# Altium project Test Board ESP32-S3 Mini.PrjPcb (part 1 of 2)
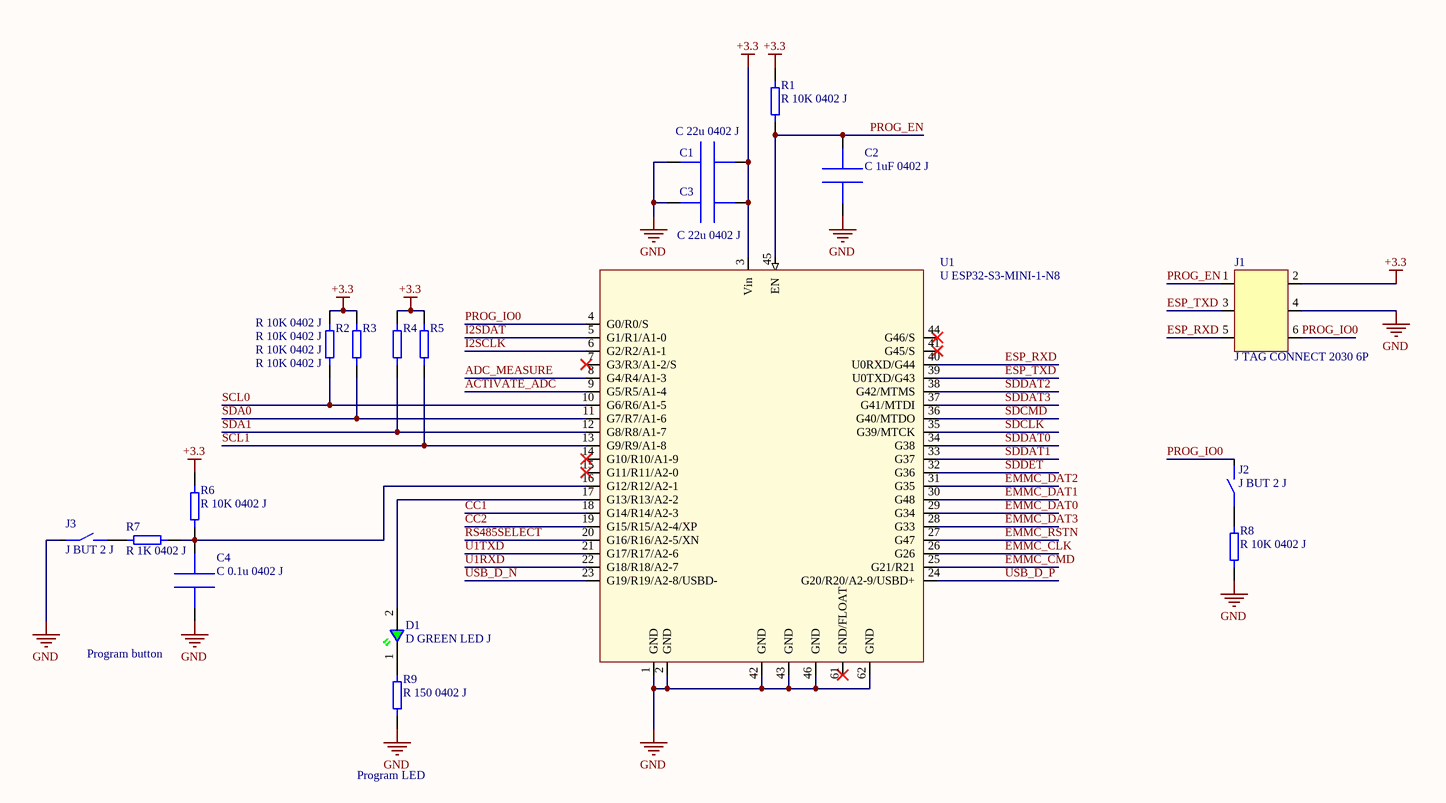
[diagram p0: MCU.SchDoc]
7 sheets, 97 parts. Net scope: global (net labels, ports and power ports of the same name join across sheets).
Board file: board.PcbDoc
Sheets:
  MCU.SchDoc
  Power.SchDoc
  USB.SchDoc
  SD-eMMC.SchDoc
  MIC.SchDoc
  Sensors.SchDoc
  RS-485.SchDoc

## Sheet MCU.SchDoc
size A3; SheetNumber: 1; SheetTotal: 2

### Parts
C1  C 22u 0402 J  [C0402]
C2  C 1uF 0402 J  [C0402]
C3  C 22u 0402 J  [C0402]
C4  C 0.1u 0402 J  [C0402]
D1  D GREEN LED J  [NCD0402C1]
J1  J TAG CONNECT 2030 6P  [TAG-CONNECT-6]  (no BOM)
J2  J BUT 2 J  [ALPSALPINE BUTTON]
J3  J BUT 2 J  [ALPSALPINE BUTTON]
R1  R 10K 0402 J  [R0402]
R2  R 10K 0402 J  [R0402]
R3  R 10K 0402 J  [R0402]
R4  R 10K 0402 J  [R0402]
R5  R 10K 0402 J  [R0402]
R6  R 10K 0402 J  [R0402]
R7  R 1K 0402 J  [R0402]
R8  R 10K 0402 J  [R0402]
R9  R 150 0402 J  [R0402]
U1  U ESP32-S3-MINI-1-N8  [ESP-S3-MINI]

### Nets
+3.3: C1.1 C3.1 J1.2 R1.2 R2.2 R3.2 R4.2 R5.2 R6.2 U1.3(Vin)
GND: C1.2 C2.1 C3.2 C4.1 J1.4 J3.1 R8.1 R9.1 U1.1(GND) U1.2(GND) U1.42(GND) U1.43(GND) U1.46(GND) U1.62(GND)
ACTIVATE_ADC: U1.9(G5/R5/A1-4)
ADC_MEASURE: U1.8(G4/R4/A1-3)
CC1: U1.18(G14/R14/A2-3)
CC2: U1.19(G15/R15/A2-4/XP)
EMMC_CLK: U1.26(G26)
EMMC_CMD: U1.25(G21/R21)
EMMC_DAT0: U1.29(G34)
EMMC_DAT1: U1.30(G48)
EMMC_DAT2: U1.31(G35)
EMMC_DAT3: U1.28(G33)
EMMC_RSTN: U1.27(G47)
ESP_RXD: J1.5 U1.40(U0RXD/G44)
ESP_TXD: J1.3 U1.39(U0TXD/G43)
I2SCLK: U1.6(G2/R2/A1-1)
I2SDAT: U1.5(G1/R1/A1-0)
PROG_EN: C2.2 J1.1 R1.1 U1.45(EN)
PROG_IO0: J1.6 J2.2 U1.4(G0/R0/S)
RS485SELECT: U1.20(G16/R16/A2-5/XN)
SCL0: R2.1 U1.10(G6/R6/A1-5)
SCL1: R5.1 U1.13(G9/R9/A1-8)
SDA~{0}: R3.1 U1.11(G7/R7/A1-6)
SDA1: R4.1 U1.12(G8/R8/A1-7)
SDCLK: U1.35(G39/MTCK)
SDCMD: U1.36(G40/MTDO)
SDDAT0: U1.34(G38)
SDDAT1: U1.33(G37)
SDDAT2: U1.38(G42/MTMS)
SDDAT3: U1.37(G41/MTDI)
SDDET: U1.32(G36)
U1RXD: U1.22(G18/R18/A2-7)
U1TXD: U1.21(G17/R17/A2-6)
USB_D_N: U1.23(G19/R19/A2-8/USBD-)
USB_D_P: U1.24(G20/R20/A2-9/USBD+)
NetC4_2: C4.2 R6.1 R7.2 U1.16(G12/R12/A2-1)
NetD1_1: D1.1 R9.2
NetD1_2: D1.2 U1.17(G13/R13/A2-2)
NetJ2_1: J2.1 R8.2
NetJ3_2: J3.2 R7.1

Not connected (* = marked no-connect by the designer): U1 7(G3/R3/A1-2/S)* 14(G10/R10/A1-9)* 15(G11/R11/A2-0)* 41(G45/S)* 44(G46/S)* 61(GND/FLOAT)*

### Notes on the sheet
- (near C4) Program button
- Program LED

### Library data of the parts
C1 C3 = C 22u 0402 J: Multi-Layer Ceramic Capacitor 22uF 2.5VDC X6S 20% 0402 Paper T/R GRM155C80E226ME11D; Manufacturer: Murata; Supplier 1: Mouser; Manufacturer Part Number: GRM155C80E226ME11D; RoHS: Yes; Category: Ceramic Capacitors; Stock 1: 30000; Pricing 1: 1=0,32000, 10=0,22300, 50=0,22300, 100=0,13400, 1000=0,08500, 10000=0,06900 (USD); Supplier Part Number 1: 81-GRM155C80E226ME1D; JLCPCB: C907955
C2 = C 1uF 0402 J: Ceramic capacitor SMD 0402 - 1000nF, 10V, +-10%, X5R CL05A105KP5NNNC; Manufacturer: Samsung; Tolerance: 10%; Supplier 1: Arrow Electronics; Manufacturer Part Number: CL05A105KP5NNNC; RoHS: Yes; Category: Ceramic Capacitors; Stock 1: 131; Pricing 1: 1=0,06300, 10=0,04210, 25=0,03040, 100=0,01620, 500=0,01020 (USD); Mount: Surface Mount; Case/Package: 0402; Case Code (Metric): 1005; Case Code (Imperial): 0402; Contact Plating: Tin; Material: Ceramic; Min Operating Temperature: -55°C; Max Operating Temperature: 85°C; Capacitance: 1uF; Package Quantity: 1; Packaging: Tape and Reel; Voltage Rating: 10V; Dielectric: X5R; Series: CL; Length: 1mm; Width: 0.02inch; Height: 0.5mm; Thickness: 0.022inch; Depth: 0.5mm; Radiation Hardening: No; RoHS Compliant: Yes; ComponentLink1URL: http://www.farnell.com/datasheets/2710650.pdf?src-supplier=Farnell; ComponentLink1Description: http://www.farnell.com/datasheets/2710650.pdf?src-supplier=Farnell; ComponentLink2URL: http://www.samsungsem.com/kr/support/product-search/mlcc/CL05A105KP5NNNC.jsp?src-supplier=Digi-Key; ComponentLink2Description: http://www.samsungsem.com/kr/support/product-search/mlcc/CL05A105KP5NNNC.jsp?src-supplier=Digi-Key; ComponentLink3URL: http://www.farnell.com/datasheets/2710650.pdf?src-supplier=Element14; ComponentLink3Description: http://www.farnell.com/datasheets/2710650.pdf?src-supplier=Element14; Supplier 2: Digi-Key; Stock 2: 6411089; Pricing 2: 1=0,10000, 10=0,03600, 50=0,01960, 100=0,01610, 500=0,01148, 1000=0,00903, 2500=0,00821, 5000=0,00755 (USD); Supplier 3: Mouser; Stock 3: 1468368; Pricing 3: 1=0,10000, 10=0,02200, 50=0,02200, 100=0,01700, 500=0,01300, 1000=0,01000, 2500=0,00900, 10000=0,00600, 50000=0,00500 (USD); Supplier Part Number 1: CL05A105KP5NNNC; Supplier Part Number 2: 1276-1076-1-ND; Supplier Part Number 3: 187-CL05A105KP5NNNC; JLCPCB: C14445
C4 = C 0.1u 0402 J: Cap Ceramic 0.1uF 50V X7R 10% Pad SMD 0402 125C Low ESR Automotive CL05B104KB54PNC; Manufacturer: Samsung; Supplier 1: Digi-Key; Manufacturer Part Number: CL05B104KB54PNC; RoHS: Yes; Category: Ceramic Capacitors; Stock 1: 3863336; Pricing 1: 1=0,10000, 10=0,04600, 50=0,02500, 100=0,02040, 500=0,01460, 1000=0,01147, 2500=0,01043, 5000=0,00959 (USD); RoHS Compliant: Yes; Supplier Part Number 1: 1276-CL05B104KB54PNCCT-ND; JLCPCB: C307331
D1 = D GREEN LED J: Green/Yellow-Green 0402 Light Emitting Diodes (LED) ROHS NCD0402C1; Manufacturer: Foshan NationStar Optoelectronics; Manufacturer Part Number: NCD0402C1; JLCPCB: C130722
J1 = J TAG CONNECT 2030 6P: Direct programming with TAG CONNECT 2030
J2 J3 = J BUT 2 J: Switch Tactile N.O. SPST Round Button Gull Wing 0.05A 12VDC 1.57N SMD T/R SKRKAEE020; Manufacturer: Alps Electric; Supplier 1: Newark; Manufacturer Part Number: SKRKAEE020; RoHS: Yes; Category: Tactile Switches; Stock 1: 31500; Pricing 1: 4500=0,13500 (USD); RoHS Compliant: Yes; Supplier 2: Mouser; Stock 2: 43207; Pricing 2: 1=0,76000, 10=0,67100, 50=0,60600, 100=0,51800, 1000=0,43900, 10000=0,37600 (USD); Supplier 3: RSComponents; JLCPCB: C115357; Supplier Part Number 3: 194714; Supplier Part Number 2: 688-SKRKAEE020; Supplier Part Number 1: 79AH6587
R1-R6 R8 = R 10K 0402 J: Res Thick Film 0402 10K Ohm 1% 0.063W(1/16W) ±100ppm/C Pad SMD Automotive T/R AC0402FR-0710KL; Manufacturer: Yageo; Resistance: 10kR; Power Rating: 62.5mW; Voltage Rating: 50V; Temperature Coefficient: 100ppm/°C; Max Power Dissipation: 63mW; Supplier 1: Arrow Electronics; Manufacturer Part Number: AC0402FR-0710KL; RoHS: Yes; Category: Chip SMD Resistors; Stock 1: 46; Pricing 1: 1=0,08140, 10=0,02850, 25=0,02750 (USD); Case/Package: 0402; Case Code (Imperial): 0402; Case Code (Metric): 1005; Size Code: 0402; Min Operating Temperature: -55°C; Max Operating Temperature: 155°C; Tolerance: 1%; Packaging: Tape and Reel; Resistor Type: Thick Film; Termination: SMD/SMT; Number of Terminations: 2; Features: Moisture Resistant,Automotive AEC-Q200; Series: AC; Construction: Rectangular; Length: 0.039inch; Width: 0.02inch; Height: 0.015inch; Depth: 0.5mm; Military Standard: Not; Lead Free: Lead Free; RoHS Compliant: Yes; ComponentLink1URL: https://datasheet.ciiva.com/12656/pyu-ac-51-rohs-l-2-12656634.pdf?src-supplier=Mouser; ComponentLink1Description: https://datasheet.ciiva.com/12656/pyu-ac-51-rohs-l-2-12656634.pdf?src-supplier=Mouser; Supplier 2: RSComponents; Stock 2: 17000; Pricing 2: 10000=0,00200 (GBP); Supplier 3: Digi-Key; Stock 3: 1574588; Pricing 3: 1=0,10000, 10=0,02000, 100=0,00830, 1000=0,00371, 2500=0,00322, 5000=0,00266 (USD); Supplier 4: Mouser; Stock 4: 3990115; Pricing 4: 1=0,10000, 10=0,01500, 50=0,01500, 100=0,00700, 1000=0,00300, 5000=0,00200, 10000=0,00200 (USD); Supplier Part Number 1: AC0402FR-0710KL; Supplier Part Number 2: 1977965; Supplier Part Number 3: YAG3436CT-ND; Supplier Part Number 4: 603-AC0402FR-0710KL; JLCPCB: C144807
R7 = R 1K 0402 J: Res Thick Film 0402 1K Ohm 1% 0.063W(1/16W) ±100ppm/C Pad SMD Automotive T/R; Manufacturer: Yageo; Manufacturer Part Number: AC0402FR-071KL; Resistance: 1kR; Power Rating: 62.5mW; Voltage Rating: 50V; Max Power Dissipation: 63mW; Temperature Coefficient: 100ppm/°C; Supplier 1: Arrow Electronics; RoHS: Yes; Category: Chip SMD Resistors; Stock 1: 269; Pricing 1: 1=0,05050, 10=0,03670, 25=0,01910, 100=0,00800, 250=0,00790 (USD); Case/Package: 0402; Case Code (Metric): 1005; Case Code (Imperial): 0402; Size Code: 0402; Min Operating Temperature: -55°C; Max Operating Temperature: 155°C; Package Quantity: 1; Tolerance: 1%; Packaging: Tape and Reel; Resistor Type: Thick Film; Number of Terminations: 2; Termination: SMD/SMT; Features: Moisture Resistant,Automotive AEC-Q200,Anti-Sulfur; Series: AC; Construction: Rectangular; Length: 0.039inch; Width: 0.02inch; Height: 0.015inch; Depth: 0.5mm; Military Standard: Not; Lead Free: Lead Free; RoHS Compliant: Yes; ComponentLink1URL: http://www.mouser.com/ds/2/447/yageodocoutput-1111992.pdf?src-supplier=Mouser; ComponentLink1Description: http://www.mouser.com/ds/2/447/yageodocoutput-1111992.pdf?src-supplier=Mouser; ComponentLink2URL: http://www.yageo.com/NewPortal/yageodocoutput?fileName=/pdf/R-Chip/PYu-AC_51_RoHS_L_6.pdf&src-supplier=Digi-Key; ComponentLink2Description: http://www.yageo.com/NewPortal/yageodocoutput?fileName=/pdf/R-Chip/PYu-AC_51_RoHS_L_6.pdf&src-supplier=Digi-Key; ComponentLink3URL: http://www.yageo.com/documents/recent/PYu-AC_51_RoHS_L_2_revised.pdf?src-supplier=Future+Electronics; ComponentLink3Description: http://www.yageo.com/documents/recent/PYu-AC_51_RoHS_L_2_revised.pdf?src-supplier=Future+Electronics; Supplier 2: RSComponents; Stock 2: 109000; Pricing 2: 5000=0,00300 (GBP); Supplier 3: Digi-Key; Stock 3: 1440182; Pricing 3: 1=0,10000, 10=0,02000, 100=0,00830, 1000=0,00371, 2500=0,00322, 5000=0,00266 (USD); Supplier 4: Mouser; Stock 4: 1563596; Pricing 4: 1=0,10000, 10=0,01500, 50=0,01500, 100=0,00700, 1000=0,00300, 10000=0,00200 (USD); Supplier Part Number 1: AC0402FR-071KL; Supplier Part Number 2: 1977971P; Supplier Part Number 3: 311-1KLBCT-ND; Supplier Part Number 4: 603-AC0402FR-071KL; JLCPCB: C144789
R9 = R 150 0402 J: Res General Purpose Thick Film 0402 150 Ohm 1% 1/16W ±100ppm/°C Molded SMD Paper T/R RC0402FR-07150RL; Manufacturer: Yageo; Resistance: 150R; Power Rating: 62.5mW; Voltage Rating: 50V; Max Power Dissipation: 63mW; Supplier 1: Arrow Electronics; Manufacturer Part Number: RC0402FR-07150RL; RoHS: Yes; Category: Chip SMD Resistors; Stock 1: 70000; Pricing 1: 10000=0,00140 (USD); Case/Package: 0402; Case Code (Metric): 1005; Case Code (Imperial): 0402; Min Operating Temperature: -55°C; Max Operating Temperature: 155°C; Tolerance: 1%; Packaging: Tape and Reel; Package Quantity: 1; Resistor Type: Thick Film; Number of Terminations: 2; Termination: SMD/SMT; Temperature Coefficient: 100ppm/°C; Working Voltage: 50V; Features: Moisture Resistant; Series: RC; Resistance Tolerance: 1%; Construction: Rectangular; Technology: THICK FILM; Length: 1mm; Width: 0.02inch; Height: 0.016inch; Depth: 0.5mm; REACH SVHC: No SVHC; Military Standard: Not; Lead Free: Lead Free; RoHS Compliant: Yes; ComponentLink1URL: https://datasheet.ciiva.com/11808/0900766b80c66297-11808422.pdf?src-supplier=RSComponents; ComponentLink1Description: https://datasheet.ciiva.com/11808/0900766b80c66297-11808422.pdf?src-supplier=RSComponents; ComponentLink2URL: https://datasheet.ciiva.com/7983/1018594-7983495.pdf?src-supplier=Element14; ComponentLink2Description: https://datasheet.ciiva.com/7983/1018594-7983495.pdf?src-supplier=Element14; ComponentLink3URL: https://datasheet.ciiva.com/2453/pyu-r-int-thick-7-2453374.pdf?src-supplier=Digi-Key; ComponentLink3Description: https://datasheet.ciiva.com/2453/pyu-r-int-thick-7-2453374.pdf?src-supplier=Digi-Key; ComponentLink4URL: https://datasheet.ciiva.com/2453/pyu-r-int-thick-7-2453375.pdf?src-supplier=Digi-Key; ComponentLink4Description: https://datasheet.ciiva.com/2453/pyu-r-int-thick-7-2453375.pdf?src-supplier=Digi-Key; ComponentLink5URL: https://datasheet.ciiva.com/2453/pyu-r-int-thick-7-2453373.pdf?src-supplier=Digi-Key; ComponentLink5Description: https://datasheet.ciiva.com/2453/pyu-r-int-thick-7-2453373.pdf?src-supplier=Digi-Key; ComponentLink6URL: https://datasheet.ciiva.com/5558/pyu-rc0402-51-rohs-l-6-r-5558110.pdf?src-supplier=Mouser; ComponentLink6Description: https://datasheet.ciiva.com/5558/pyu-rc0402-51-rohs-l-6-r-5558110.pdf?src-supplier=Mouser; ComponentLink7URL: https://datasheet.ciiva.com/7849/1018594-7849838.pdf?src-supplier=Element14; ComponentLink7Description: https://datasheet.ciiva.com/7849/1018594-7849838.pdf?src-supplier=Element14; ComponentLink8URL: https://datasheet.ciiva.com/7849/1018594-7849839.pdf?src-supplier=Element14; ComponentLink8Description: https://datasheet.ciiva.com/7849/1018594-7849839.pdf?src-supplier=Element14; ComponentLink9URL: https://datasheet.ciiva.com/16740/pyu-rc0402-51-rohs-l-6-r-16740923.pdf?src-supplier=Future+Electronics; ComponentLink9Description: https://datasheet.ciiva.com/16740/pyu-rc0402-51-rohs-l-6-r-16740923.pdf?src-supplier=Future+Electronics; ComponentLink10URL: https://datasheet.ciiva.com/15189/getdatasheetpartid-330680-15189357.pdf?src-supplier=Verical; ComponentLink10Description: https://datasheet.ciiva.com/15189/getdatasheetpartid-330680-15189357.pdf?src-supplier=Verical; Supplier 2: RSComponents; Stock 2: 10800; Pricing 2: 10000=0,00200, 50000=0,00200, 100000=0,00200, 200000=0,00200, 400000=0,00200 (GBP); Supplier 3: Digi-Key; Stock 3: 2629290; Pricing 3: 1=0,10000, 10=0,01500, 100=0,00610, 1000=0,00275, 2500=0,00239, 5000=0,00197 (USD); JLCPCB: C138054; Supplier Part Number 1: RC0402FR-07150RL; Supplier Part Number 2: 1987666; Supplier Part Number 3: 311-150LRCT-ND
U1 = U ESP32-S3-MINI-1-N8: SMD Module, ESP32-S3FN8, 8 mb Sp ESP32-S3-MINI-1-N8; Manufacturer: Espressif Systems; Supplier 1: Digi-Key; Manufacturer Part Number: ESP32-S3-MINI-1-N8; RoHS: No; Category: Uncategorized; Stock 1: 6782; Pricing 1: 1=3,41000 (USD); JLCPCB: C2913206; Supplier Part Number 1: 1965-ESP32-S3-MINI-1-N8-ND; ComponentLink1Description: Real datasheet; ComponentLink1URL: https://www.espressif.com/sites/default/files/documentation/esp32-s3-mini-1_mini-1u_datasheet_en.pdf

## Sheet Power.SchDoc
size A4; SheetNumber: 2; SheetTotal: 2
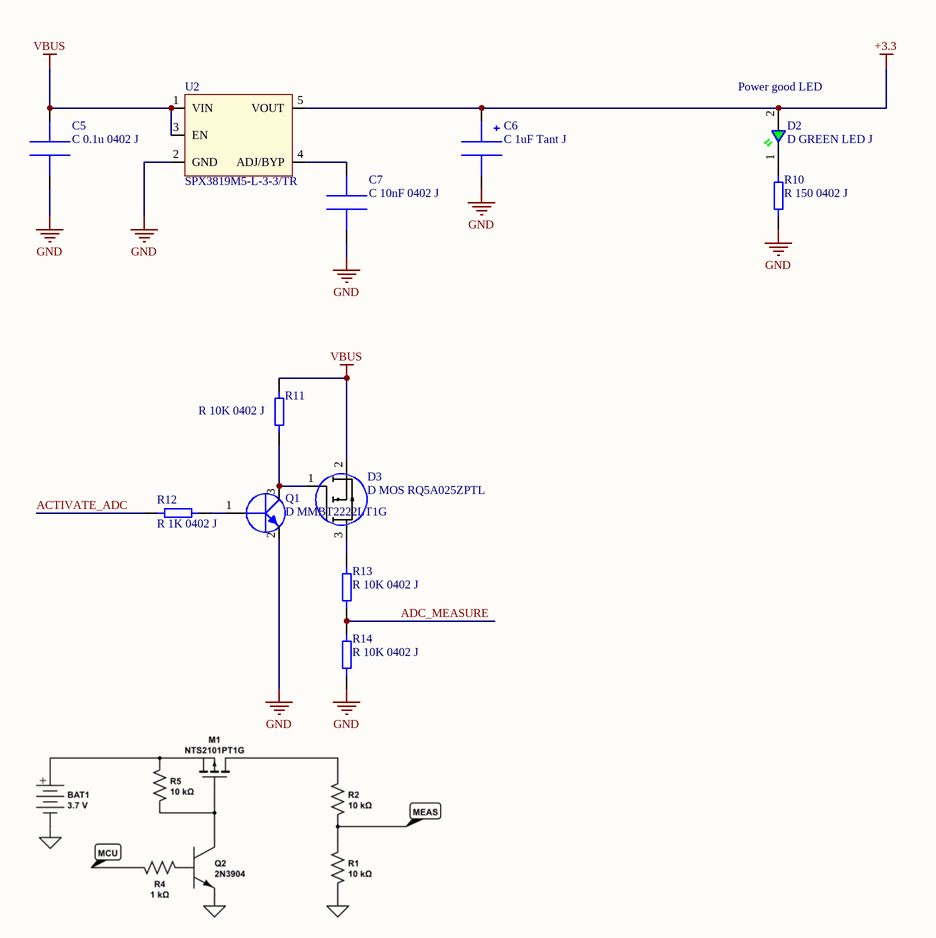
[diagram p1: Power.SchDoc]

### Parts
C5  C 0.1u 0402 J  [C0402]
C6  C 1uF Tant J  [C AVX CAP TANT CASE A]
C7  C 10nF 0402 J  [C0402]
D2  D GREEN LED J  [NCD0402C1]
D3  D MOS RQ5A025ZPTL  [SC96 SOT346T]
Q1  D MMBT2222LT1G  [SOT23]
R10  R 150 0402 J  [R0402]
R11  R 10K 0402 J  [R0402]
R12  R 1K 0402 J  [R0402]
R13  R 10K 0402 J  [R0402]
R14  R 10K 0402 J  [R0402]
U2  SPX3819M5-L-3-3/TR  [SOT23-5]

### Nets
+3.3: C6.A D2.2 U2.5(VOUT)
GND: C5.1 C6.K C7.1 Q1.2 R10.1 R14.1 U2.2(GND)
VBUS: C5.2 D3.2(S) R11.2 U2.1(VIN) U2.3(EN)
ACTIVATE_ADC: R12.1
ADC_MEASURE: R13.1 R14.2
NetC7_2: C7.2 U2.4(ADJ/BYP)
NetD2_1: D2.1 R10.2
NetD3_1: D3.1(G) Q1.3 R11.1
NetD3_3: D3.3(D) R13.2
NetQ1_1: Q1.1 R12.2

### Notes on the sheet
- (near D2) Power good LED

### Library data of the parts
C5 = C 0.1u 0402 J: as C4 on sheet MCU; Supplier 1: Digi-Key; Manufacturer Part Number: CL05B104KB54PNC; RoHS: Yes; Category: Ceramic Capacitors; Stock 1: 3863336; Pricing 1: 1=0,10000, 10=0,04600, 50=0,02500, 100=0,02040, 500=0,01460, 1000=0,01147, 2500=0,01043, 5000=0,00959 (USD); RoHS Compliant: Yes; Supplier Part Number 1: 1276-CL05B104KB54PNCCT-ND; JLCPCB: C307331
C6 = C 1uF Tant J: Cap Tant Solid 1uF 16V A CASE 10%( 3.2 X 1.6 X 1.6mm) Inward L SMD 3216-18 11 Ohm 125C T/R TAJA105K016RNJ; Manufacturer: Kyocera AVX; Dielectric Material: Tantalum; Tolerance: 20%; ESR (Equivalent Series Resistance): 11R; Polarity: Polar; Leakage Current: 500nA; Dissipation Factor: 4%; Supplier 1: Digi-Key; Manufacturer Part Number: TAJA105K016RNJ; RoHS: Yes; Category: Tantalum Capacitors; Stock 1: 449202; Pricing 1: 2000=0,09159, 4000=0,08650, 10000=0,08141, 14000=0,07886, 50000=0,07123 (USD); Mount: Surface Mount,PCB; Case/Package: 1206; Number of Pins: 2; Case Code (Metric): 3216; Case Code (Imperial): 1206; Weight: 0.000571oz; Min Operating Temperature: -55°C; Max Operating Temperature: 125°C; Capacitance: 1uF; Voltage Rating (DC): 16V; Packaging: Tape and Reel; Package Quantity: 1; Voltage Rating: 16V; Termination: SMD/SMT; Voltage: 16V; Features: General Purpose; Series: TAJ; Length: 3.2mm; Width: 1.6mm; Height: 1.6mm; Height - Seated (Max): 0.071inch; Depth: 1.6mm; Lead Pitch: 1.1mm; Radiation Hardening: No; REACH SVHC: No SVHC; Lead Free: Lead Free; RoHS Compliant: Yes; ComponentLink1URL: https://datasheet.ciiva.com/18710/taj-eng-18710647.pdf?src-supplier=Distrelec; ComponentLink1Description: https://datasheet.ciiva.com/18710/taj-eng-18710647.pdf?src-supplier=Distrelec; ComponentLink2URL: https://datasheet.ciiva.com/7832/taj-7832811.pdf?src-supplier=Element14; ComponentLink2Description: https://datasheet.ciiva.com/7832/taj-7832811.pdf?src-supplier=Element14; ComponentLink3URL: https://datasheet.ciiva.com/7832/taj-7832810.pdf?src-supplier=Element14; ComponentLink3Description: https://datasheet.ciiva.com/7832/taj-7832810.pdf?src-supplier=Element14; ComponentLink4URL: https://datasheet.ciiva.com/7832/1680476-7832431.pdf?src-supplier=Element14; ComponentLink4Description: https://datasheet.ciiva.com/7832/1680476-7832431.pdf?src-supplier=Element14; ComponentLink5URL: https://datasheet.ciiva.com/263/taj-263410.pdf?src-supplier=Digi-Key; ComponentLink5Description: https://datasheet.ciiva.com/263/taj-263410.pdf?src-supplier=Digi-Key; ComponentLink6URL: https://datasheet.ciiva.com/263/taj-263409.pdf?src-supplier=Digi-Key; ComponentLink6Description: https://datasheet.ciiva.com/263/taj-263409.pdf?src-supplier=Digi-Key; ComponentLink7URL: https://datasheet.ciiva.com/263/taj-263411.pdf?src-supplier=Digi-Key; ComponentLink7Description: https://datasheet.ciiva.com/263/taj-263411.pdf?src-supplier=Digi-Key; ComponentLink8URL: https://datasheet.ciiva.com/7832/1703059-7832429.pdf?src-supplier=Element14; ComponentLink8Description: https://datasheet.ciiva.com/7832/1703059-7832429.pdf?src-supplier=Element14; ComponentLink9URL: https://datasheet.ciiva.com/7832/1703059-7832430.pdf?src-supplier=Element14; ComponentLink9Description: https://datasheet.ciiva.com/7832/1703059-7832430.pdf?src-supplier=Element14; Supplier 2: RSComponents; Stock 2: 1; Pricing 2: 20=0,28300, 100=0,27000, 200=0,25900, 500=0,23500, 1000=0,20900 (USD); JLCPCB: C7174; Supplier Part Number 1: 478-1649-2-ND; Supplier Part Number 2: 1360127
C7 = C 10nF 0402 J: Ceramic capacitor SMD-0402 10nF /50V X7R# K +-10%, Samsung, RoHS CL05B103KB5NNNC; Tolerance: 10%; Voltage Rating: 50V; Dielectric: X7R; Supplier 1: Arrow Electronics; Manufacturer: Samsung; Manufacturer Part Number: CL05B103KB5NNNC; RoHS: Yes; Category: Ceramic Capacitors; Stock 1: 6530000; Pricing 1: 10000=0,00290, 20000=0,00230, 50000=0,00210, 100000=0,00190 (USD); Mount: Surface Mount; Case/Package: 0402; Case Code (Metric): 1005; Case Code (Imperial): 0402; Material: Ceramic; Contact Plating: Tin; Min Operating Temperature: -55°C; Max Operating Temperature: 125°C; Packaging: Tape and Reel; Capacitance: 10nF; Package Quantity: 1; Voltage: 50V; Voltage Rating (DC): 50V; Series: CL; Construction: Flat; Length: 1mm; Width: 0.02inch; Height: 0.5mm; Thickness: 0.022inch; Depth: 0.5mm; Radiation Hardening: No; Lead Free: Lead Free; RoHS Compliant: Yes; ComponentLink1URL: https://datasheet.ciiva.com/15195/getdatasheetpartid-359682-15195636.pdf?src-supplier=Verical; ComponentLink1Description: https://datasheet.ciiva.com/15195/getdatasheetpartid-359682-15195636.pdf?src-supplier=Verical; ComponentLink2URL: https://datasheet.ciiva.com/29198/458761-da-01-en-vs-kondensator-0402-29198432.pdf?src-supplier=Conrad; ComponentLink2Description: https://datasheet.ciiva.com/29198/458761-da-01-en-vs-kondensator-0402-29198432.pdf?src-supplier=Conrad; ComponentLink3URL: https://datasheet.ciiva.com/26309/mlcc-catalogdownload2013-eng-26309005.pdf?src-supplier=Distrelec; ComponentLink3Description: https://datasheet.ciiva.com/26309/mlcc-catalogdownload2013-eng-26309005.pdf?src-supplier=Distrelec; Supplier 2: Digi-Key; Stock 2: 14692768; Pricing 2: 1=0,10000, 10=0,01500, 50=0,00820, 100=0,00670, 500=0,00478, 1000=0,00375, 2500=0,00341, 5000=0,00314 (USD); Supplier 3: Mouser; Stock 3: 2909879; Pricing 3: 1=0,10000, 10=0,00900, 50=0,00900, 100=0,00700, 500=0,00600, 1000=0,00500, 2500=0,00400, 10000=0,00300, 20000=0,00200 (USD); Supplier Part Number 1: CL05B103KB5NNNC; Supplier Part Number 2: 1276-1028-1-ND; Supplier Part Number 3: 187-CL05B103KB5NNNC; JLCPCB: C15195
D2 = D GREEN LED J: as D1 on sheet MCU; Manufacturer Part Number: NCD0402C1; JLCPCB: C130722; ComponentLink1Description: Datasheet; ComponentLink1URL: https://datasheet.lcsc.com/lcsc/2008201033_Foshan-NationStar-Optoelectronics-NCD0402C1_C130722.pdf
D3 = D MOS RQ5A025ZPTL: Transistor Mosfet P-ch 12V 2.5A 3-PIN Tsmt T/r; Manufacturer: Rohm; Supplier 1: Mouser; Manufacturer Part Number: RQ5A025ZPTL; RoHS: Yes; Category: MOSFETs; Stock 1: 4907; Pricing 1: 1=0,58000, 10=0,49900, 50=0,49900, 100=0,37300, 1000=0,24300, 10000=0,20200 (USD); Supplier Part Number 1: 755-RQ5A025ZPTL
Q1 = D MMBT2222LT1G: Trans GP BJT NPN 30V 0.6A 3-Pin SOT-23 T/R; Manufacturer: ON Semiconductor; hFE Min: 100; Frequency: 250MHz; Max Power Dissipation: 225mW; Number of Elements: 1; Max Collector Current: 600mA; Collector Base Voltage (VCBO): 60V; Emitter Base Voltage (VEBO): 5V; Collector Emitter Saturation Voltage: 1.6V; Power Dissipation: 300mW; Element Configuration: Single; Supplier 1: RSComponents; Manufacturer Part Number: MMBT2222LT1G; RoHS: Yes; Category: BJTs; Stock 1: 1600; Pricing 1: 200=0,04200 (USD); Case/Package: SOT-23-3; Number of Pins: 3; Weight: 0.01lb; Contact Plating: Tin,Matte; Min Operating Temperature: -55°C; Max Operating Temperature: 150°C; Collector Emitter Voltage (VCEO): 30V; Package Quantity: 1; Packaging: Tape and Reel; Transition Frequency: 250MHz; Collector Emitter Breakdown Voltage: 30V; Max Breakdown Voltage: 30V; Polarity: NPN; Max Frequency: 250MHz; Termination: SMD/SMT; Gain Bandwidth Product: 250MHz; Voltage Rating (DC): 30V; Current Rating: 600mA; Length: 3.04mm; Width: 2.64mm; Height: 1.11mm; Radiation Hardening: No; REACH SVHC: No SVHC; Lead Free: Lead Free; RoHS Compliant: Yes; ComponentLink1URL: https://datasheet.ciiva.com/976/mmbt2222lt1-d-976368.pdf?src-supplier=Digi-Key; ComponentLink1Description: https://datasheet.ciiva.com/976/mmbt2222lt1-d-976368.pdf?src-supplier=Digi-Key; ComponentLink2URL: https://datasheet.ciiva.com/976/mmbt2222lt1-d-976369.pdf?src-supplier=Digi-Key; ComponentLink2Description: https://datasheet.ciiva.com/976/mmbt2222lt1-d-976369.pdf?src-supplier=Digi-Key; ComponentLink3URL: https://datasheet.ciiva.com/976/mmbt2222lt1-d-976370.pdf?src-supplier=Digi-Key; ComponentLink3Description: https://datasheet.ciiva.com/976/mmbt2222lt1-d-976370.pdf?src-supplier=Digi-Key; ComponentLink4URL: https://datasheet.ciiva.com/7972/mmbt2222lt1-d-7972376.pdf?src-supplier=Element14; ComponentLink4Description: https://datasheet.ciiva.com/7972/mmbt2222lt1-d-7972376.pdf?src-supplier=Element14; ComponentLink5URL: https://datasheet.ciiva.com/22664/1644026-22664155.pdf?src-supplier=Element14; ComponentLink5Description: https://datasheet.ciiva.com/22664/1644026-22664155.pdf?src-supplier=Element14; ComponentLink6URL: https://datasheet.ciiva.com/4721/mmbt2222lt1-d-80103-4721468.pdf?src-supplier=Mouser; ComponentLink6Description: https://datasheet.ciiva.com/4721/mmbt2222lt1-d-80103-4721468.pdf?src-supplier=Mouser; ComponentLink7URL: https://datasheet.ciiva.com/11198/mmbt2222lt1-d-11198974.pdf?src-supplier=Avnet; ComponentLink7Description: https://datasheet.ciiva.com/11198/mmbt2222lt1-d-11198974.pdf?src-supplier=Avnet; ComponentLink8URL: https://datasheet.ciiva.com/11201/mmbt2222lt1-d-11201758.pdf?src-supplier=Avnet; ComponentLink8Description: https://datasheet.ciiva.com/11201/mmbt2222lt1-d-11201758.pdf?src-supplier=Avnet; ComponentLink9URL: https://datasheet.ciiva.com/15224/getdatasheetpartid-91924-15224358.pdf?src-supplier=Verical; ComponentLink9Description: https://datasheet.ciiva.com/15224/getdatasheetpartid-91924-15224358.pdf?src-supplier=Verical; ComponentLink10URL: https://datasheet.ciiva.com/26115/mmbt2222lt1-d-26115112.pdf?src-supplier=Avnet+Europe; ComponentLink10Description: https://datasheet.ciiva.com/26115/mmbt2222lt1-d-26115112.pdf?src-supplier=Avnet+Europe; Supplier Part Number 1: 7814222; JLCPCB: C43496
R10 = R 150 0402 J: as R9 on sheet MCU; Supplier 1: Arrow Electronics; Manufacturer Part Number: RC0402FR-07150RL; RoHS: Yes; Category: Chip SMD Resistors; Stock 1: 70000; Pricing 1: 10000=0,00140 (USD); Case/Package: 0402; Case Code (Metric): 1005; Case Code (Imperial): 0402; Min Operating Temperature: -55°C; Max Operating Temperature: 155°C; Tolerance: 1%; Packaging: Tape and Reel; Package Quantity: 1; Resistor Type: Thick Film; Number of Terminations: 2; Termination: SMD/SMT; Temperature Coefficient: 100ppm/°C; Working Voltage: 50V; Features: Moisture Resistant; Series: RC; Resistance Tolerance: 1%; Construction: Rectangular; Technology: THICK FILM; Length: 1mm; Width: 0.02inch; Height: 0.016inch; Depth: 0.5mm; REACH SVHC: No SVHC; Military Standard: Not; Lead Free: Lead Free; RoHS Compliant: Yes; ComponentLink1URL: https://datasheet.ciiva.com/11808/0900766b80c66297-11808422.pdf?src-supplier=RSComponents; ComponentLink1Description: https://datasheet.ciiva.com/11808/0900766b80c66297-11808422.pdf?src-supplier=RSComponents; ComponentLink2URL: https://datasheet.ciiva.com/7983/1018594-7983495.pdf?src-supplier=Element14; ComponentLink2Description: https://datasheet.ciiva.com/7983/1018594-7983495.pdf?src-supplier=Element14; ComponentLink3URL: https://datasheet.ciiva.com/2453/pyu-r-int-thick-7-2453374.pdf?src-supplier=Digi-Key; ComponentLink3Description: https://datasheet.ciiva.com/2453/pyu-r-int-thick-7-2453374.pdf?src-supplier=Digi-Key; ComponentLink4URL: https://datasheet.ciiva.com/2453/pyu-r-int-thick-7-2453375.pdf?src-supplier=Digi-Key; ComponentLink4Description: https://datasheet.ciiva.com/2453/pyu-r-int-thick-7-2453375.pdf?src-supplier=Digi-Key; ComponentLink5URL: https://datasheet.ciiva.com/2453/pyu-r-int-thick-7-2453373.pdf?src-supplier=Digi-Key; ComponentLink5Description: https://datasheet.ciiva.com/2453/pyu-r-int-thick-7-2453373.pdf?src-supplier=Digi-Key; ComponentLink6URL: https://datasheet.ciiva.com/5558/pyu-rc0402-51-rohs-l-6-r-5558110.pdf?src-supplier=Mouser; ComponentLink6Description: https://datasheet.ciiva.com/5558/pyu-rc0402-51-rohs-l-6-r-5558110.pdf?src-supplier=Mouser; ComponentLink7URL: https://datasheet.ciiva.com/7849/1018594-7849838.pdf?src-supplier=Element14; ComponentLink7Description: https://datasheet.ciiva.com/7849/1018594-7849838.pdf?src-supplier=Element14; ComponentLink8URL: https://datasheet.ciiva.com/7849/1018594-7849839.pdf?src-supplier=Element14; ComponentLink8Description: https://datasheet.ciiva.com/7849/1018594-7849839.pdf?src-supplier=Element14; ComponentLink9URL: https://datasheet.ciiva.com/16740/pyu-rc0402-51-rohs-l-6-r-16740923.pdf?src-supplier=Future+Electronics; ComponentLink9Description: https://datasheet.ciiva.com/16740/pyu-rc0402-51-rohs-l-6-r-16740923.pdf?src-supplier=Future+Electronics; ComponentLink10URL: https://datasheet.ciiva.com/15189/getdatasheetpartid-330680-15189357.pdf?src-supplier=Verical; ComponentLink10Description: https://datasheet.ciiva.com/15189/getdatasheetpartid-330680-15189357.pdf?src-supplier=Verical; Supplier 2: RSComponents; Stock 2: 10800; Pricing 2: 10000=0,00200, 50000=0,00200, 100000=0,00200, 200000=0,00200, 400000=0,00200 (GBP); Supplier 3: Digi-Key; Stock 3: 2629290; Pricing 3: 1=0,10000, 10=0,01500, 100=0,00610, 1000=0,00275, 2500=0,00239, 5000=0,00197 (USD); JLCPCB: C138054; Supplier Part Number 1: RC0402FR-07150RL; Supplier Part Number 2: 1987666; Supplier Part Number 3: 311-150LRCT-ND
R11 R13 R14 = R 10K 0402 J: as R1 on sheet MCU; Supplier 1: Arrow Electronics; Manufacturer Part Number: AC0402FR-0710KL; RoHS: Yes; Category: Chip SMD Resistors; Stock 1: 46; Pricing 1: 1=0,08140, 10=0,02850, 25=0,02750 (USD); Case/Package: 0402; Case Code (Imperial): 0402; Case Code (Metric): 1005; Size Code: 0402; Min Operating Temperature: -55°C; Max Operating Temperature: 155°C; Tolerance: 1%; Packaging: Tape and Reel; Resistor Type: Thick Film; Termination: SMD/SMT; Number of Terminations: 2; Features: Moisture Resistant,Automotive AEC-Q200; Series: AC; Construction: Rectangular; Length: 0.039inch; Width: 0.02inch; Height: 0.015inch; Depth: 0.5mm; Military Standard: Not; Lead Free: Lead Free; RoHS Compliant: Yes; ComponentLink1URL: https://datasheet.ciiva.com/12656/pyu-ac-51-rohs-l-2-12656634.pdf?src-supplier=Mouser; ComponentLink1Description: https://datasheet.ciiva.com/12656/pyu-ac-51-rohs-l-2-12656634.pdf?src-supplier=Mouser; Supplier 2: RSComponents; Stock 2: 17000; Pricing 2: 10000=0,00200 (GBP); Supplier 3: Digi-Key; Stock 3: 1574588; Pricing 3: 1=0,10000, 10=0,02000, 100=0,00830, 1000=0,00371, 2500=0,00322, 5000=0,00266 (USD); Supplier 4: Mouser; Stock 4: 3990115; Pricing 4: 1=0,10000, 10=0,01500, 50=0,01500, 100=0,00700, 1000=0,00300, 5000=0,00200, 10000=0,00200 (USD); Supplier Part Number 1: AC0402FR-0710KL; Supplier Part Number 2: 1977965; Supplier Part Number 3: YAG3436CT-ND; Supplier Part Number 4: 603-AC0402FR-0710KL; JLCPCB: C144807
R12 = R 1K 0402 J: as R7 on sheet MCU; Supplier 1: Arrow Electronics; RoHS: Yes; Category: Chip SMD Resistors; Stock 1: 269; Pricing 1: 1=0,05050, 10=0,03670, 25=0,01910, 100=0,00800, 250=0,00790 (USD); Case/Package: 0402; Case Code (Metric): 1005; Case Code (Imperial): 0402; Size Code: 0402; Min Operating Temperature: -55°C; Max Operating Temperature: 155°C; Package Quantity: 1; Tolerance: 1%; Packaging: Tape and Reel; Resistor Type: Thick Film; Number of Terminations: 2; Termination: SMD/SMT; Features: Moisture Resistant,Automotive AEC-Q200,Anti-Sulfur; Series: AC; Construction: Rectangular; Length: 0.039inch; Width: 0.02inch; Height: 0.015inch; Depth: 0.5mm; Military Standard: Not; Lead Free: Lead Free; RoHS Compliant: Yes; ComponentLink1URL: http://www.mouser.com/ds/2/447/yageodocoutput-1111992.pdf?src-supplier=Mouser; ComponentLink1Description: http://www.mouser.com/ds/2/447/yageodocoutput-1111992.pdf?src-supplier=Mouser; ComponentLink2URL: http://www.yageo.com/NewPortal/yageodocoutput?fileName=/pdf/R-Chip/PYu-AC_51_RoHS_L_6.pdf&src-supplier=Digi-Key; ComponentLink2Description: http://www.yageo.com/NewPortal/yageodocoutput?fileName=/pdf/R-Chip/PYu-AC_51_RoHS_L_6.pdf&src-supplier=Digi-Key; ComponentLink3URL: http://www.yageo.com/documents/recent/PYu-AC_51_RoHS_L_2_revised.pdf?src-supplier=Future+Electronics; ComponentLink3Description: http://www.yageo.com/documents/recent/PYu-AC_51_RoHS_L_2_revised.pdf?src-supplier=Future+Electronics; Supplier 2: RSComponents; Stock 2: 109000; Pricing 2: 5000=0,00300 (GBP); Supplier 3: Digi-Key; Stock 3: 1440182; Pricing 3: 1=0,10000, 10=0,02000, 100=0,00830, 1000=0,00371, 2500=0,00322, 5000=0,00266 (USD); Supplier 4: Mouser; Stock 4: 1563596; Pricing 4: 1=0,10000, 10=0,01500, 50=0,01500, 100=0,00700, 1000=0,00300, 10000=0,00200 (USD); Supplier Part Number 1: AC0402FR-071KL; Supplier Part Number 2: 1977971P; Supplier Part Number 3: 311-1KLBCT-ND; Supplier Part Number 4: 603-AC0402FR-071KL; JLCPCB: C144789
U2 = U SPX3819M5 3.3V: SPX3819 Series 3.3 V 500 mA Fixed Output SMT LDO Regulator - SOT-23-5; Manufacturer: MaxLinear; Supplier 1: Mouser; Manufacturer Part Number: SPX3819M5-L-3-3/TR; RoHS: Yes; Category: Voltage Regulators - Linear; Stock 1: 726; Pricing 1: 1=0,56000, 10=0,45600, 50=0,45600, 100=0,32800, 1000=0,21500, 10000=0,19500 (USD); RoHS Compliant: Yes; Supplier 2: RSComponents; Stock 2: 290; Pricing 2: 10=0,59100, 50=0,46800, 100=0,45400, 250=0,39800, 500=0,33700, 10=0,42700, 50=0,33800, 100=0,32800, 250=0,28700, 500=0,24300 (USD); Supplier Part Number 2: 8472888; Supplier Part Number 1: 701-SPX3819M5-L-33TR; JLCPCB: C9055

## Sheet USB.SchDoc
size A4
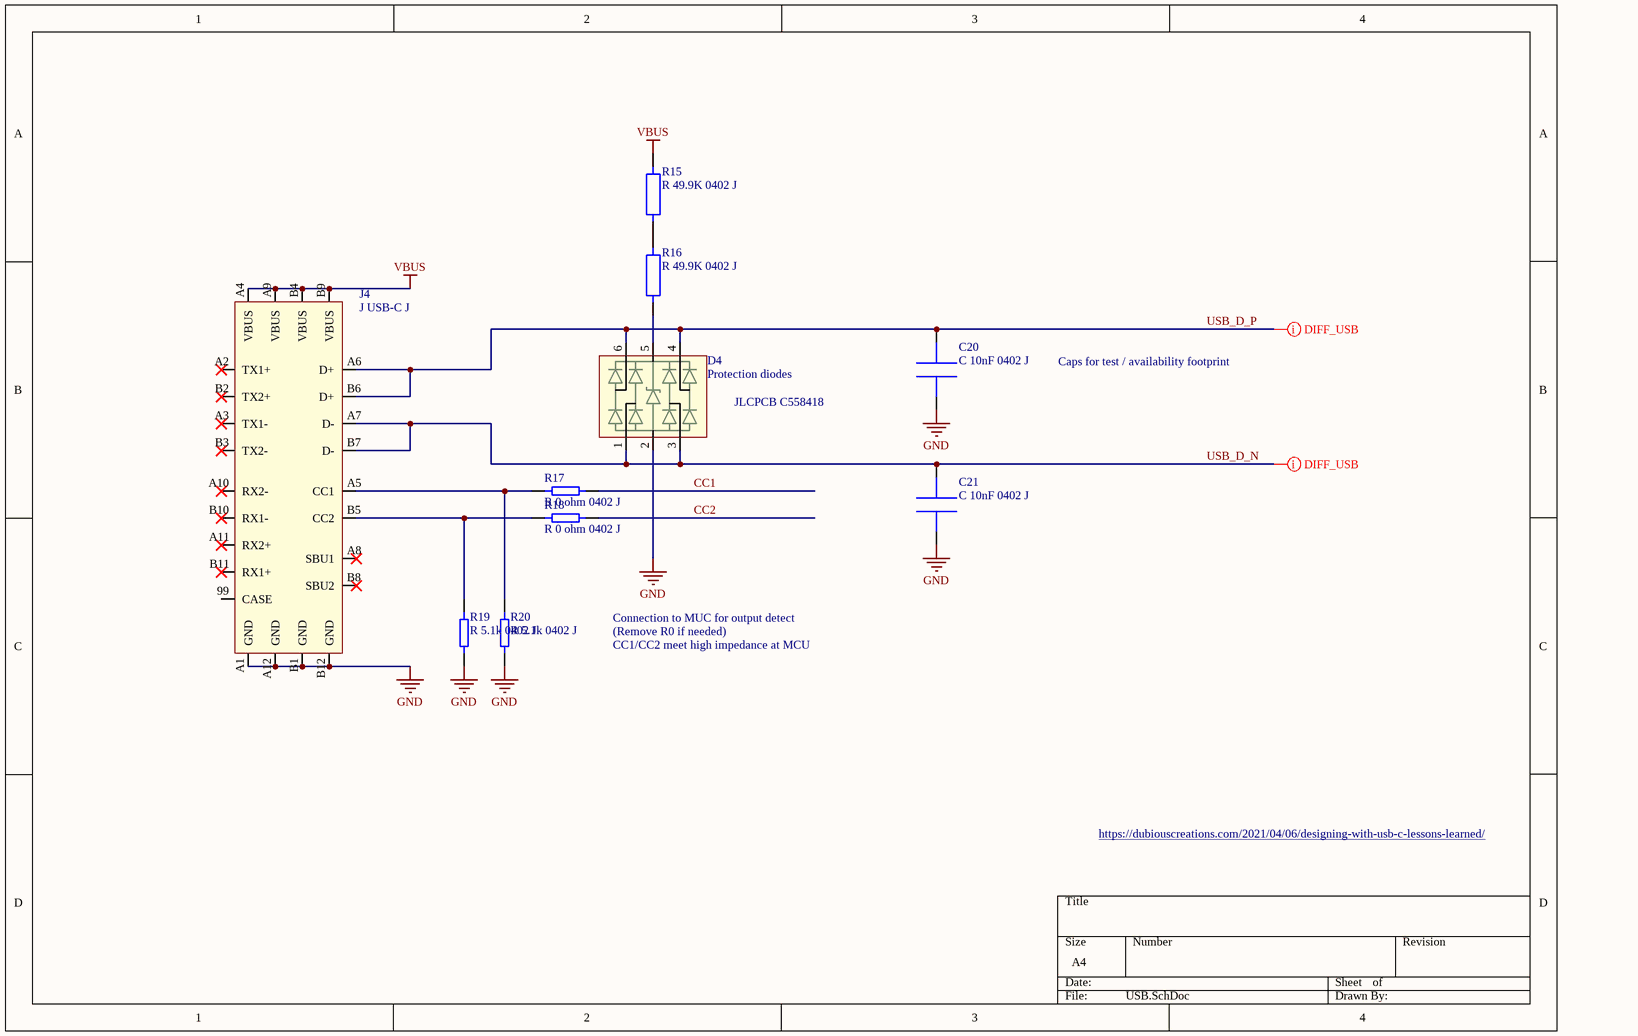
[diagram p2: USB.SchDoc]

### Parts
C20  C 10nF 0402 J  [C0402]
C21  C 10nF 0402 J  [C0402]
D4  Protection diodes  [SOT23-SRV05]
J4  J USB-C J  [MOLEX USB-C 1054500101]
R15  R 49.9K 0402 J  [R0402]
R16  R 49.9K 0402 J  [R0402]
R17  R 0 ohm 0402 J  [R0402]
R18  R 0 ohm 0402 J  [R0402]
R19  R 5.1k 0402 J  [R0402]
R20  R 5.1k 0402 J  [R0402]

### Nets
GND: C20.1 C21.1 D4.2 J4.A1(GND) J4.A12(GND) J4.B1(GND) J4.B12(GND) R19.1 R20.1
VBUS: J4.A4(VBUS) J4.A9(VBUS) J4.B4(VBUS) J4.B9(VBUS) R15.2
CC1: R17.2
CC2: R18.2
USB_D_N: C21.2 D4.1 D4.3 J4.A7(D-) J4.B7(D-)
USB_D_P: C20.2 D4.4 D4.6 J4.A6(D+) J4.B6(D+)
NetD4_5: D4.5 R16.1
NetJ4_A5: J4.A5(CC1) R17.1 R20.2
NetJ4_B5: J4.B5(CC2) R18.1 R19.2
NetR15_1: R15.1 R16.2

Not connected (* = marked no-connect by the designer): J4 99(CASE) A2(TX1+)* A3(TX1-)* A8(SBU1)* A10(RX2-)* A11(RX2+)* B2(TX2+)* B3(TX2-)* B8(SBU2)* B10(RX1-)* B11(RX1+)*

### Layout directives
differential pair: USB_D_N, USB_D_P

### Notes on the sheet
- Caps for test / availability footprint
- JLCPCB C558418
- Connection to MUC for output detect
- (Remove R0 if needed)
- CC1/CC2 meet high impedance at MCU
- https://dubiouscreations.com/2021/04/06/designing-with-usb-c-lessons-learned/

### Library data of the parts
C20 C21 = C 10nF 0402 J: as C7 on sheet Power; Supplier 1: Arrow Electronics; Manufacturer: Samsung; Manufacturer Part Number: CL05B103KB5NNNC; RoHS: Yes; Category: Ceramic Capacitors; Stock 1: 6530000; Pricing 1: 10000=0,00290, 20000=0,00230, 50000=0,00210, 100000=0,00190 (USD); Mount: Surface Mount; Case/Package: 0402; Case Code (Metric): 1005; Case Code (Imperial): 0402; Material: Ceramic; Contact Plating: Tin; Min Operating Temperature: -55°C; Max Operating Temperature: 125°C; Packaging: Tape and Reel; Capacitance: 10nF; Package Quantity: 1; Voltage: 50V; Voltage Rating (DC): 50V; Series: CL; Construction: Flat; Length: 1mm; Width: 0.02inch; Height: 0.5mm; Thickness: 0.022inch; Depth: 0.5mm; Radiation Hardening: No; Lead Free: Lead Free; RoHS Compliant: Yes; ComponentLink1URL: https://datasheet.ciiva.com/15195/getdatasheetpartid-359682-15195636.pdf?src-supplier=Verical; ComponentLink1Description: https://datasheet.ciiva.com/15195/getdatasheetpartid-359682-15195636.pdf?src-supplier=Verical; ComponentLink2URL: https://datasheet.ciiva.com/29198/458761-da-01-en-vs-kondensator-0402-29198432.pdf?src-supplier=Conrad; ComponentLink2Description: https://datasheet.ciiva.com/29198/458761-da-01-en-vs-kondensator-0402-29198432.pdf?src-supplier=Conrad; ComponentLink3URL: https://datasheet.ciiva.com/26309/mlcc-catalogdownload2013-eng-26309005.pdf?src-supplier=Distrelec; ComponentLink3Description: https://datasheet.ciiva.com/26309/mlcc-catalogdownload2013-eng-26309005.pdf?src-supplier=Distrelec; Supplier 2: Digi-Key; Stock 2: 14692768; Pricing 2: 1=0,10000, 10=0,01500, 50=0,00820, 100=0,00670, 500=0,00478, 1000=0,00375, 2500=0,00341, 5000=0,00314 (USD); Supplier 3: Mouser; Stock 3: 2909879; Pricing 3: 1=0,10000, 10=0,00900, 50=0,00900, 100=0,00700, 500=0,00600, 1000=0,00500, 2500=0,00400, 10000=0,00300, 20000=0,00200 (USD); Supplier Part Number 1: CL05B103KB5NNNC; Supplier Part Number 2: 1276-1028-1-ND; Supplier Part Number 3: 187-CL05B103KB5NNNC; JLCPCB: C15195
D4 = D SRV05-4.TCT: SEMTECH - SRV05-4.TCT - ESD Protection Device, TVS, 17.5 V, SOT-23, 6 Pins, 5 V, 300 W; Capacitance: 5pF; Direction: Unidirectional; Reverse Breakdown Voltage: 6V; Number of Elements: 1; Number of Channels: 4; Operating Supply Voltage: 5V; Clamping Voltage: 17.5V; Peak Pulse Power: 300W; Power Line Protection: Yes; Leakage Current: 5uA; Peak Pulse Current: 12A; Test Current: 1mA; Current: 5A; Supplier 1: RSComponents; Manufacturer: Semtech; Manufacturer Part Number: SRV05-4.TCT; RoHS: Yes; Category: TVS Diodes; Stock 1: 425; Pricing 1: 5=1,18100, 25=0,88900, 50=0,77200, 125=0,72400, 250=0,69400 (USD); Mount: Surface Mount; Case/Package: SOT-23; Number of Pins: 6; Min Operating Temperature: -55°C; Max Operating Temperature: 125°C; Packaging: Tape and Reel; Number of Bidirectional Channels: 4; Reverse Standoff Voltage: 5V; Min Breakdown Voltage: 6V; Polarity: Unidirectional; Working Voltage: 5V; ESD Protection: Yes; Max Reverse Leakage Current: 5uA; Max Breakdown Voltage: 6V; Max Power Dissipation: 300W; Voltage Rating (DC): 5V; Breakdown Voltage: 6V; Voltage: 5V; Series: RailClamp®, SR; Clamping Voltage-Max: 17.5V; Length: 2.9mm; Width: 1.6mm; Height: 1.15mm; Depth: 1.6mm; Radiation Hardening: No; REACH SVHC: No SVHC; Lead Free: Lead Free; RoHS Compliant: Yes; ComponentLink1URL: https://datasheet.ciiva.com/18065/getdatasheetpartid-93542-18065216.pdf?src-supplier=Verical; ComponentLink1Description: https://datasheet.ciiva.com/18065/getdatasheetpartid-93542-18065216.pdf?src-supplier=Verical; ComponentLink2URL: https://datasheet.ciiva.com/8029/srv05-4-8029973.pdf?src-supplier=Element14; ComponentLink2Description: https://datasheet.ciiva.com/8029/srv05-4-8029973.pdf?src-supplier=Element14; ComponentLink3URL: https://datasheet.ciiva.com/26787/srv05-4-tct-26787453.pdf?src-supplier=IIIC; ComponentLink3Description: https://datasheet.ciiva.com/26787/srv05-4-tct-26787453.pdf?src-supplier=IIIC; ComponentLink4URL: https://datasheet.ciiva.com/11193/srv05-4-11193639.pdf?src-supplier=Avnet; ComponentLink4Description: https://datasheet.ciiva.com/11193/srv05-4-11193639.pdf?src-supplier=Avnet; ComponentLink5URL: https://datasheet.ciiva.com/16396/srv05-4-16396600.pdf?src-supplier=Future+Electronics; ComponentLink5Description: https://datasheet.ciiva.com/16396/srv05-4-16396600.pdf?src-supplier=Future+Electronics; ComponentLink6URL: https://datasheet.ciiva.com/25955/srv05-4-25955769.pdf?src-supplier=Avnet+Europe; ComponentLink6Description: https://datasheet.ciiva.com/25955/srv05-4-25955769.pdf?src-supplier=Avnet+Europe; ComponentLink7URL: https://datasheet.ciiva.com/338/srv05-4-338860.pdf?src-supplier=Digi-Key; ComponentLink7Description: https://datasheet.ciiva.com/338/srv05-4-338860.pdf?src-supplier=Digi-Key; ComponentLink8URL: https://datasheet.ciiva.com/338/srv05-4-338861.pdf?src-supplier=Digi-Key; ComponentLink8Description: https://datasheet.ciiva.com/338/srv05-4-338861.pdf?src-supplier=Digi-Key; ComponentLink9URL: https://datasheet.ciiva.com/338/srv05-4-338862.pdf?src-supplier=Digi-Key; ComponentLink9Description: https://datasheet.ciiva.com/338/srv05-4-338862.pdf?src-supplier=Digi-Key; Supplier Part Number 1: 6910883; JLCPCB: C13612
J4 = J USB-C J: Conn USB 3.1 Type C F 24 POS Solder RA SMD 24 Terminal 1 Port USB 3.1 T/R 105450-0101; Manufacturer: Molex; Supplier 1: Arrow Electronics; Manufacturer Part Number: 105450-0101; RoHS: Yes; Category: USB Connectors; Stock 1: 1720; Pricing 1: 1=2,36000, 10=1,98100, 25=1,94300, 100=1,88000, 250=1,81800, 500=1,75500, 1000=1,69300 (USD); ComponentLink1URL: http://www.farnell.com/datasheets/2801634.pdf?src-supplier=Farnell; ComponentLink1Description: http://www.farnell.com/datasheets/2801634.pdf?src-supplier=Farnell; ComponentLink2URL: http://www.farnell.com/datasheets/2672741.pdf?src-supplier=Newark; ComponentLink2Description: http://www.farnell.com/datasheets/2672741.pdf?src-supplier=Newark; ComponentLink3URL: https://www.molex.com/pdm_docs/ps/PS-105448-001.pdf?src-supplier=Digi-Key; ComponentLink3Description: https://www.molex.com/pdm_docs/ps/PS-105448-001.pdf?src-supplier=Digi-Key; ComponentLink4URL: https://www.molex.com/pdm_docs/sd/1054500101_sd.pdf?src-supplier=Digi-Key; ComponentLink4Description: https://www.molex.com/pdm_docs/sd/1054500101_sd.pdf?src-supplier=Digi-Key; ComponentLink5URL: http://www.literature.molex.com/SQLImages/kelmscott/Molex/PDF_Images/987651-4081.PDF?src-supplier=Avnet; ComponentLink5Description: http://www.literature.molex.com/SQLImages/kelmscott/Molex/PDF_Images/987651-4081.PDF?src-supplier=Avnet; ComponentLink6URL: http://www.farnell.com/datasheets/2801634.pdf?src-supplier=Newark; ComponentLink6Description: http://www.farnell.com/datasheets/2801634.pdf?src-supplier=Newark; ComponentLink7URL: http://www.farnell.com/datasheets/2801634.pdf?src-supplier=Element14; ComponentLink7Description: http://www.farnell.com/datasheets/2801634.pdf?src-supplier=Element14; ComponentLink8URL: http://www.farnell.com/datasheets/2015275.pdf?src-supplier=Element14; ComponentLink8Description: http://www.farnell.com/datasheets/2015275.pdf?src-supplier=Element14; Supplier 2: RSComponents; Stock 2: 1; Pricing 2: 5=2,95300, 15=2,60200, 65=2,46800, 325=2,04900, 650=1,99600 (USD); Supplier 3: Digi-Key; Stock 3: 42891; Pricing 3: 1=2,68000, 10=2,28300, 100=1,88600 (USD); Supplier 4: Mouser; Stock 4: 76331; Pricing 4: 1=2,65000, 10=2,27000, 50=2,27000, 100=1,87000, 500=1,72000, 1000=1,72000, 1300=1,48000, 2600=1,37000, 3900=1,30000, 9100=1,27000, 10000=1,30000, 24700=1,22000 (USD); JLCPCB: C134092; Supplier Part Number 1: 105450-0101; Supplier Part Number 2: 9209199; Supplier Part Number 3: WM12856CT-ND; Supplier Part Number 4: 538-105450-0101
R15 R16 = R 49.9K 0402 J: Res General Purpose Thick Film 0402 49.9K Ohm 1% 1/16W ±100ppm/°C Molded SMD Paper T/R RC0402FR-0749K9L; Manufacturer: Yageo; Power Rating: 62.5mW; Resistance: 49.9kR; Voltage Rating: 50V; Max Power Dissipation: 63mW; Supplier 1: Arrow Electronics; Manufacturer Part Number: RC0402FR-0749K9L; RoHS: Yes; Category: Chip SMD Resistors; Stock 1: 3590000; Pricing 1: 10000=0,00180, 30000=0,00160, 50000=0,00140, 100000=0,00140 (USD); Case/Package: 0402; Case Code (Imperial): 0402; Case Code (Metric): 1005; Size Code: 0402; Min Operating Temperature: -55°C; Max Operating Temperature: 155°C; Tolerance: 1%; Packaging: Tape and Reel; Termination: SMD/SMT; Resistor Type: Thick Film; Temperature Coefficient: 100ppm/°C; Voltage Rating (DC): 50V; Features: Moisture Resistant; Series: RC; Number of Terminations: 2; Construction: Rectangular; Length: 1mm; Depth: 0.5mm; Military Standard: Not; Lead Free: Lead Free; RoHS Compliant: Yes; ComponentLink1URL: https://datasheet.ciiva.com/17071/pyu-rc0402-51-rohs-l-6-r-17071066.pdf?src-supplier=Future+Electronics; ComponentLink1Description: https://datasheet.ciiva.com/17071/pyu-rc0402-51-rohs-l-6-r-17071066.pdf?src-supplier=Future+Electronics; Supplier 2: RSComponents; Stock 2: 9900; Pricing 2: 10000=0,00200, 50000=0,00200, 100000=0,00200, 200000=0,00200, 400000=0,00200 (GBP); Supplier 3: Digi-Key; Stock 3: 8421822; Pricing 3: 1=0,10000, 10=0,01500, 100=0,00610, 1000=0,00275, 2500=0,00239, 5000=0,00197 (USD); Supplier 4: Mouser; Stock 4: 1268211; Pricing 4: 1=0,10000, 10=0,01800, 50=0,01800, 100=0,00800, 1000=0,00500, 10000=0,00200 (USD); JLCPCB: C137969; Supplier Part Number 2: 1987804; Supplier Part Number 3: 311-49.9KLRDKR-ND; Supplier Part Number 4: 603-RC0402FR-0749K9L; Supplier Part Number 1: RC0402FR-0749K9L
R17 R18 = R 0 ohm 0402 J: RC Series 0402 0.063 W 0 Ohm Jumper Surface Mount Thick Film Chip Resistor RC0402FR-070RL; Manufacturer: Yageo; Resistance: 0R; Tolerance: 1%; Power Rating: 62.5mW; Voltage Rating: 50V; Temperature Coefficient: 200ppm/°C; Max Power Dissipation: 63mW; Supplier 1: Arrow Electronics; Manufacturer Part Number: RC0402FR-070RL; RoHS: Yes; Category: Chip SMD Resistors; Stock 1: 810000; Pricing 1: 10000=0,00120, 30000=0,00110, 50000=0,00100 (USD); Mount: Surface Mount; Case/Package: 0402; Contact Plating: Tin,Matte; Case Code (Imperial): 0402; Case Code (Metric): 1005; Size Code: 0402; Min Operating Temperature: -55°C; Max Operating Temperature: 155°C; Resistor Type: Thick Film; Packaging: Tape and Reel; Termination: SMD/SMT; Features: Moisture Resistant; Series: RC; Number of Terminations: 2; Length: 1mm; Width: 0.5mm; Height: 0.35mm; Radiation Hardening: No; Lead Free: Lead Free; RoHS Compliant: Yes; ComponentLink1URL: https://datasheet.ciiva.com/8896/pyu-rc0402-51-rohs-l-6-8896149.pdf?src-supplier=Avnet; ComponentLink1Description: https://datasheet.ciiva.com/8896/pyu-rc0402-51-rohs-l-6-8896149.pdf?src-supplier=Avnet; ComponentLink2URL: https://datasheet.ciiva.com/16790/pyu-rc0402-51-rohs-l-6-r-16790444.pdf?src-supplier=Future+Electronics; ComponentLink2Description: https://datasheet.ciiva.com/16790/pyu-rc0402-51-rohs-l-6-r-16790444.pdf?src-supplier=Future+Electronics; Supplier 2: Digi-Key; Stock 2: 9382775; Pricing 2: 1=0,10000, 10=0,01200, 25=0,00840, 50=0,00640, 100=0,00480, 250=0,00364, 500=0,00290, 1000=0,00214, 5000=0,00154 (USD); Supplier 3: Mouser; Stock 3: 8133261; Pricing 3: 1=0,10000, 10=0,01400, 50=0,01400, 100=0,00600, 1000=0,00300, 5000=0,00200, 10000=0,00100 (USD); JLCPCB: C106231; Supplier Part Number 1: RC0402FR-070RL; Supplier Part Number 2: 311-0.0LRCT-ND; Supplier Part Number 3: 603-RC0402FR-070RL
R19 R20 = R 5.1k 0402 J: Res Thick Film 1.0 x 0.5 mm 5.1K Ohm 1% 0.063W(1/16W) 100ppm/ C Molded SMD Paper T/R RC0402FR-075K1L; Manufacturer: Yageo; Power Rating: 63mW; Resistance: 5.1kR; Temperature Coefficient: 100ppm/°C; Voltage Rating: 50V; Supplier 1: Arrow Electronics; Manufacturer Part Number: RC0402FR-075K1L; RoHS: Yes; Category: Chip SMD Resistors; Stock 1: 170000; Pricing 1: 10000=0,00180, 30000=0,00160, 50000=0,00140, 100000=0,00140 (USD); Case/Package: 0402; Case Code (Metric): 1005; Case Code (Imperial): 0402; Min Operating Temperature: -55°C; Max Operating Temperature: 155°C; Tolerance: 1%; Technology: THICK FILM; Packaging: Tape and Reel; Package Quantity: 1; Resistor Type: Thick Film; Number of Terminations: 2; Termination: SMD/SMT; Max Power Dissipation: 63mW; Voltage Rating (DC): 50V; Working Voltage: 50V; Features: Moisture Resistant; Series: RC; Resistance Tolerance: 1%; Construction: Rectangular; Length: 1mm; Width: 0.02inch; Height: 0.016inch; Depth: 0.5mm; RoHS Compliant: Yes; REACH SVHC: Unknown; Military Standard: Not; Lead Free: Lead Free; ComponentLink1URL: https://datasheet.ciiva.com/7983/1018594-7983519.pdf?src-supplier=Element14; ComponentLink1Description: https://datasheet.ciiva.com/7983/1018594-7983519.pdf?src-supplier=Element14; ComponentLink2URL: https://datasheet.ciiva.com/46394/1018594-46394936.pdf?src-supplier=Element14; ComponentLink2Description: https://datasheet.ciiva.com/46394/1018594-46394936.pdf?src-supplier=Element14; ComponentLink3URL: https://datasheet.ciiva.com/2453/pyu-r-int-thick-7-2453401.pdf?src-supplier=Digi-Key; ComponentLink3Description: https://datasheet.ciiva.com/2453/pyu-r-int-thick-7-2453401.pdf?src-supplier=Digi-Key; ComponentLink4URL: https://datasheet.ciiva.com/2453/pyu-r-int-thick-7-2453402.pdf?src-supplier=Digi-Key; ComponentLink4Description: https://datasheet.ciiva.com/2453/pyu-r-int-thick-7-2453402.pdf?src-supplier=Digi-Key; ComponentLink5URL: https://datasheet.ciiva.com/2453/pyu-r-int-thick-7-2453400.pdf?src-supplier=Digi-Key; ComponentLink5Description: https://datasheet.ciiva.com/2453/pyu-r-int-thick-7-2453400.pdf?src-supplier=Digi-Key; ComponentLink6URL: https://datasheet.ciiva.com/12558/pyu-rc0402-51-rohs-l-6-r-8721-12558460.pdf?src-supplier=Mouser; ComponentLink6Description: https://datasheet.ciiva.com/12558/pyu-rc0402-51-rohs-l-6-r-8721-12558460.pdf?src-supplier=Mouser; ComponentLink7URL: https://datasheet.ciiva.com/16744/pyu-rc0402-51-rohs-l-6-r-16744283.pdf?src-supplier=Future+Electronics; ComponentLink7Description: https://datasheet.ciiva.com/16744/pyu-rc0402-51-rohs-l-6-r-16744283.pdf?src-supplier=Future+Electronics; ComponentLink8URL: https://datasheet.ciiva.com/15189/getdatasheetpartid-323636-15189493.pdf?src-supplier=Verical; ComponentLink8Description: https://datasheet.ciiva.com/15189/getdatasheetpartid-323636-15189493.pdf?src-supplier=Verical; Supplier 2: RSComponents; Stock 2: 17100; Pricing 2: 10000=0,00100 (GBP); Supplier 3: Mouser; Stock 3: 769920; Pricing 3: 1=0,10000, 10=0,01200, 50=0,01200, 100=0,00500, 1000=0,00300, 2500=0,00200, 10000=0,00100 (USD); JLCPCB: C105872; Supplier Part Number 1: RC0402FR-075K1L; Supplier Part Number 2: 1987834; Supplier Part Number 3: 603-RC0402FR-075K1L